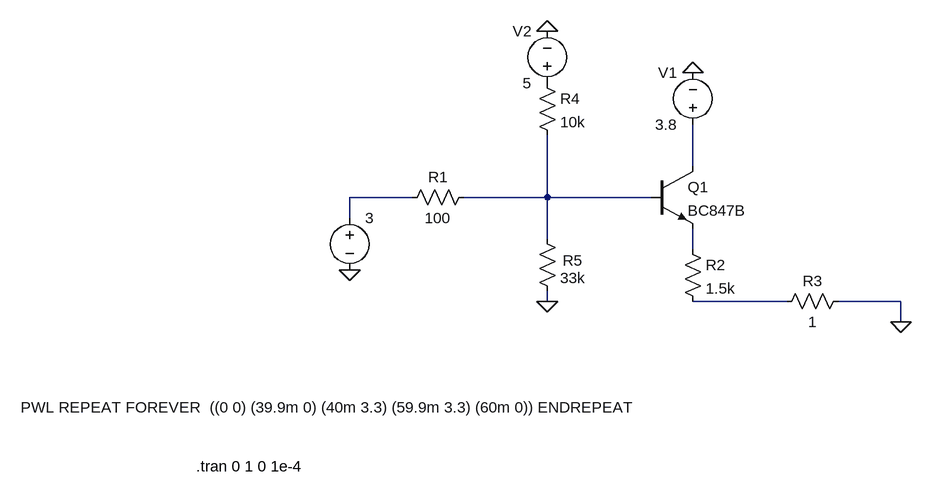
[diagram p0: schematic Draft1.asc]
Draft1.asc, the LTspice schematic file:
Version 4
SHEET 1 880 680
WIRE 192 80 192 16
WIRE -240 128 -336 128
WIRE -32 128 -32 32
WIRE -32 128 -160 128
WIRE 128 128 -32 128
WIRE -336 160 -336 128
WIRE -32 192 -32 128
WIRE 192 208 192 176
WIRE -32 288 -32 272
WIRE 336 288 192 288
WIRE 512 288 416 288
WIRE 512 320 512 288
FLAG 192 -64 0
FLAG 512 320 0
FLAG -336 240 0
FLAG -32 288 0
FLAG -32 -128 0
SYMBOL npn 128 80 R0
SYMATTR InstName Q1
SYMATTR Value BC847B
SYMBOL res -144 112 R90
WINDOW 0 0 56 VBottom 2
WINDOW 3 32 56 VTop 2
SYMATTR InstName R1
SYMATTR Value 100
SYMBOL voltage 192 32 R180
WINDOW 0 24 96 Left 2
WINDOW 3 24 16 Left 2
WINDOW 123 0 0 Left 0
WINDOW 39 0 0 Left 0
SYMATTR InstName V1
SYMATTR Value 3.8
SYMBOL res 176 192 R0
SYMATTR InstName R2
SYMATTR Value 1.5k
SYMBOL res 432 272 R90
WINDOW 0 0 56 VBottom 2
WINDOW 3 32 56 VTop 2
SYMATTR InstName R3
SYMATTR Value 1
SYMBOL voltage -336 144 R0
WINDOW 3 -506 307 Left 2
SYMATTR Value PWL REPEAT FOREVER  ((0 0) (39.9m 0) (40m 3.3) (59.9m 3.3) (60m 0)) ENDREPEAT
SYMATTR InstName 3
SYMBOL res -48 -64 R0
SYMATTR InstName R4
SYMATTR Value 10k
SYMBOL res -48 176 R0
WINDOW 0 40 49 Left 2
SYMATTR InstName R5
SYMATTR Value 33k
SYMBOL voltage -32 -32 R180
WINDOW 0 24 96 Left 2
WINDOW 3 24 16 Left 2
WINDOW 123 0 0 Left 0
WINDOW 39 0 0 Left 0
SYMATTR InstName V2
SYMATTR Value 5
TEXT -572 542 Left 2 !.tran 0 1 0 1e-4

The netlist it stands for:
* Draft1.asc
Q1 N001 N003 N004 0 BC847B
R1 N003 N002 100
V1 N001 0 3.8
R2 N004 N005 1.5k
R3 0 N005 1
V§3 N002 0 PWL REPEAT FOREVER  ((0 0) (39.9m 0) (40m 3.3) (59.9m 3.3) (60m 0)) ENDREPEAT
R4 P001 N003 10k
R5 N003 0 33k
V2 P001 0 5
.model NPN NPN
.model PNP PNP
.lib standard.bjt
.tran 0 1 0 1e-4
.backanno
.end